# EAGLE design 9V-Reg (EAGLE 7.1.0)
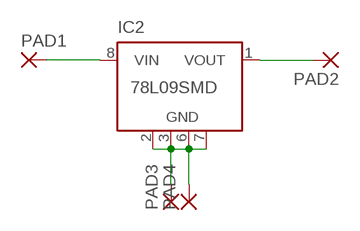
[diagram p0: schematic, sheet 1]

## Parts
IC2  78L09SMD  78L05SMD  [SO08]
PAD1  SMD2  [SMD1,27-2,54]
PAD2  SMD2  [SMD1,27-2,54]
PAD3  SMD2  [SMD1,27-2,54]
PAD4  SMD2  [SMD1,27-2,54]

## Nets
N$1: IC2.2(GND) IC2.3(GND) IC2.6(GND) IC2.7(GND) PAD3.1(P) PAD4.1(P)
N$3: IC2.8(VIN) PAD1.1(P)
N$4: IC2.1(VOUT) PAD2.1(P)
Unconnected: IC2.4(NC) IC2.5(NC)

## Library data of the parts
IC2 = linear:78L*SMD: Positive VOLTAGE REGULATOR
PAD1-PAD4 = wirepad:SMD2: SMD PAD

## Board
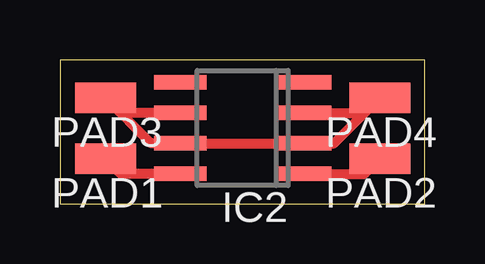
[diagram p1: board, top side]

Size 15.22 x 6.02 mm. Coordinates in mm from the lower left corner, seen from the top.
Outline: 0,0 15.22,0 15.22,6.02 0,6.02 0,0
Copper layers (1*16): Top 0.035mm / dielectric 1.5mm / Bottom 0.035mm
Design rules "default": minimum track width 10mil, minimum drill 24mil, track to track 8mil, track to pad 8mil, pad to pad 8mil, via to via 8mil, smd to smd 8mil, copper to edge 40mil, drill to drill 8mil, minimum pad ring 10mil, minimum via ring 8mil, stop-mask expansion 4mil, vias tented up to drill 0mil, thermal gap 10mil

### Footprints (pad centres in the part's own frame; a part is rotated, then mirrored left to right if it is on the bottom)
SO08 = smd 0.6 x 2.2: 1 -1.905,-2.6; 2 -0.635,-2.6; 3 0.635,-2.6; 4 1.905,-2.6; 5 1.905,2.6; 6 0.635,2.6; 7 -0.635,2.6; 8 -1.905,2.6
SMD1,27-2,54 = smd 1.27 x 2.54: 1 0,0

### Placement (x,y rotation side)
IC2  7.62,3.17 90 top
PAD1  1.91,1.91 90 top
PAD2  13.34,1.91 90 top
PAD3  1.91,4.45 90 top
PAD4  13.34,4.45 90 top

### Tracks (layer width: path | path; a pad name or v marks a point on that pad's centre or on a via)
N$1
  Top 0.406: IC2.6 2.54,3.81 PAD3.1 3.81,2.54 IC2.7 IC2.2 11.43,2.54 12.7,3.81 | IC2.3 12.7,3.81 | 12.7,3.81 PAD4.1
N$3
  Top 0.406: IC2.8 2.54,1.27 PAD1.1
N$4
  Top 0.406: IC2.1 12.7,1.27 PAD2.1